# Altium schematic sheet 425AK01A_S04.SchDoc
size A3; DocumentNumber: 4; SheetNumber: 4; SheetTotal: 10; PageSetup: Record=PageOptions|CenterHorizontal=True|CenterVertical=True|PrintScale=1.01|XCorrection=1.00|YCorrection=1.00|PrintKind=1|BorderSize=5000000|LeftOffset=0|BottomOffset=0|Orientation=2|PaperLength=1000|PaperWidth=1000|Scale=100|PaperSource=15|PrintQuality=600|MediaType=1|DitherType=10|PaperKind=A3|PrintScaleMode=1; 00_Drawn: RJG; 00_Date: 8APR2022; 00_Checked: SR; 00_Approved: GN; 00_Line1: VCXO/PLL PATH A
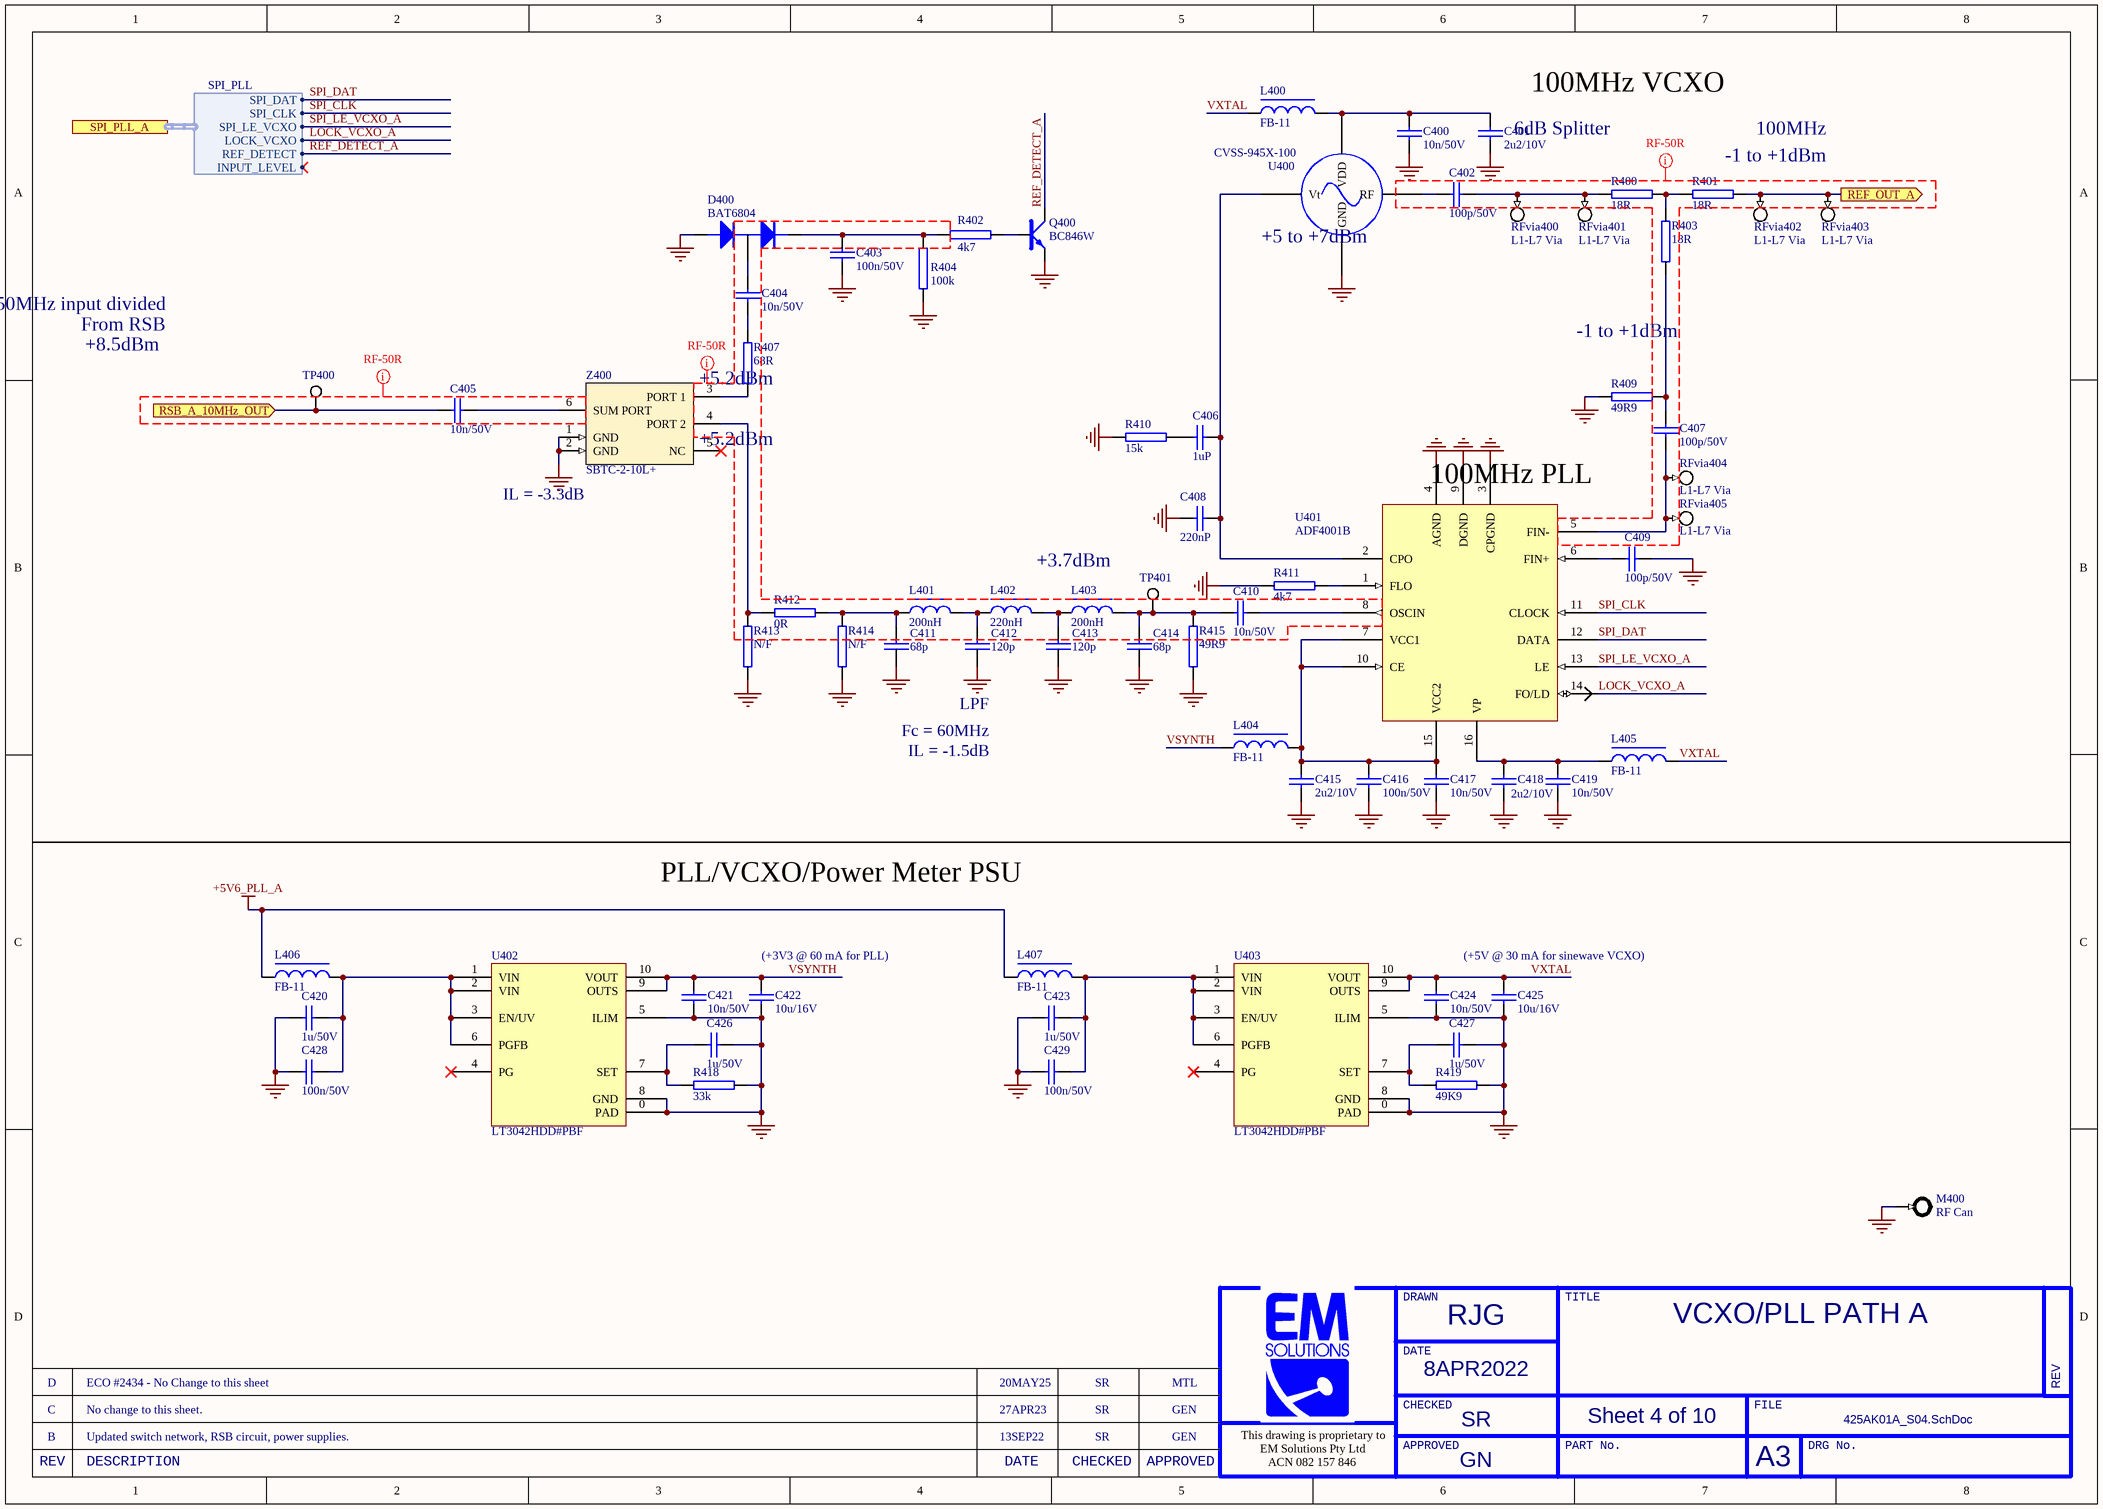
[diagram p0: 425AK01A_S04.SchDoc]

## Parts
C400  10n/50V  [0402C]
C401  2u2/10V  [0603C]
C402  100p/50V  [0402C]
C403  100n/50V  [0402C]
C404  10n/50V  [0402C]
C405  10n/50V  [0402C]
C406  1uP  [1210C]
C407  100p/50V  [0402C]
C408  220nP  [1206C]
C409  100p/50V  [0402C]
C410  10n/50V  [0402C]
C411  68p  [0402C]
C412  120p  [0402C]
C413  120p  [0402C]
C414  68p  [0402C]
C415  2u2/10V  [0603C]
C416  100n/50V  [0402C]
C417  10n/50V  [0402C]
C418  2u2/10V  [0603C]
C419  10n/50V  [0402C]
C420  1u/50V  [0603C]
C421  10n/50V  [0402C]
C422  10u/16V  [0805C]
C423  1u/50V  [0603C]
C424  10n/50V  [0402C]
C425  10u/16V  [0805C]
C426  1u/50V  [0603C]
C427  1u/50V  [0603C]
C428  100n/50V  [0402C]
C429  100n/50V  [0402C]
D400  BAT6804  [SOT-23DAP]
L400  FB-11  [0402L]
L401  200nH  [0402L]
L402  220nH  [0402L]
L403  200nH  [0402L]
L404  FB-11  [0402L]
L405  FB-11  [0402L]
L406  FB-11  [0402L]
L407  FB-11  [0402L]
M400  RF Can  [Can_38x25.4x6mm]
Q400  BC846W  [SOT-323BJT]
R400  18R  [0402]
R401  18R  [0402]
R402  4k7  [0402]
R403  18R  [0402]
R404  100k  [0402]
R407  68R  [0402]
R409  49R9  [0402]
R410  15k  [0402]
R411  4k7  [0402]
R412  0R  [0402]
R413  N/F  [0402]
R414  N/F  [0402]
R415  49R9  [0402]
R418  33k  [0402]
R419  49K9  [0402]
RFvia400  L1-L7 Via  [RFvia_L1-L7]  (no BOM)
RFvia401  L1-L7 Via  [RFvia_L1-L7]  (no BOM)
RFvia402  L1-L7 Via  [RFvia_L1-L7]  (no BOM)
RFvia403  L1-L7 Via  [RFvia_L1-L7]  (no BOM)
RFvia404  L1-L7 Via  [RFvia_L1-L7]  (no BOM)
RFvia405  L1-L7 Via  [RFvia_L1-L7]  (no BOM)
TP400  Pad  [Testpoint-0.5mm-SMT-withPaste]  (value not drawn)  (no BOM)
TP401  Pad  [Testpoint-0.5mm-SMT-withPaste]  (value not drawn)  (no BOM)
U400  CVSS-945X-100  [CVHD-950]
U401  ADF4001B  [TSSOP-16]
U402  LT3042HDD#PBF  [DFN50P300X300X80_HS-11N]
U403  LT3042HDD#PBF  [DFN50P300X300X80_HS-11N]
Z400  SBTC-2-10L+  [SBTC-2-10L+]

## Ports
REF_OUT_A (out), RSB_A_10MHz_OUT (in), SPI_PLL_A (harness SPI_PLL)

## Harnesses
SPI_PLL: SPI_LE_VCXO, SPI_CLK, SPI_DAT, REF_DETECT, LOCK_VCXO, INPUT_LEVEL

## Nets
+5V6_PLL_A: L406.2 L407.2
GND: C400.2 C401.2 C403.1 C408.1 C409.2 C411.1 C412.1 C413.1 C414.1 C415.2 C416.2 C417.2 C418.2 C419.2 C420.1 C421.1 C422.2 C423.1 C424.1 C425.2 C426.2 C427.2 C428.2 C429.2 D400.A M400.0 Q400.E R404.1 R409.2 R410.2 R411.1 R413.1 R414.1 R415.1 R418.1 R419.1 U400.2(GND) U401.3(CPGND) U401.4(AGND) U401.9(DGND) U402.0(PAD) U402.5(ILIM) U402.8(GND) U403.0(PAD) U403.5(ILIM) U403.8(GND) Z400.1(GND) Z400.2(GND)
LOCK_VCXO_A: U401.14(FO/LD) ; port SPI_PLL_A.LOCK_VCXO
REF_DETECT_A: Q400.C ; port SPI_PLL_A.REF_DETECT
REF_OUT_A: R401.2 RFvia402.1 RFvia403.1 ; port REF_OUT_A
RSB_A_10MHz_OUT: C405.1 TP400.1 ; port RSB_A_10MHz_OUT
SPI_CLK: U401.11(CLOCK) ; port SPI_PLL_A.SPI_CLK
SPI_DAT: U401.12(DATA) ; port SPI_PLL_A.SPI_DAT
SPI_LE_VCXO_A: U401.13(LE) ; port SPI_PLL_A.SPI_LE_VCXO
VSYNTH: C421.2 C422.1 L404.1 U402.9(OUTS) U402.10(VOUT)
VXTAL: C424.2 C425.1 L400.1 L405.2 U403.9(OUTS) U403.10(VOUT)
NetC400_1: C400.1 C401.1 L400.2 U400.4(VDD)
NetC402_1: C402.1 R400.1 RFvia400.1 RFvia401.1
NetC402_2: C402.2 U400.3(RF)
NetC403_2: C403.2 D400.K R402.2 R404.2
NetC404_1: C404.1 R407.2
NetC404_2: C404.2 D400.KA
NetC405_2: C405.2 Z400.6(SUM_PORT)
NetC406_1: C406.1 C408.2 U400.1(Vt) U401.2(CPO)
NetC406_2: C406.2 R410.1
NetC407_1: C407.1 R403.2 R409.1
NetC407_2: C407.2 RFvia404.1 RFvia405.1 U401.5(FIN-)
NetC409_1: C409.1 U401.6(FIN+)
NetC410_1: C410.1 C414.2 L403.2 R415.2 TP401.1
NetC410_2: C410.2 U401.8(OSCIN)
NetC411_2: C411.2 L401.1 R412.1 R414.2
NetC412_2: C412.2 L401.2 L402.1
NetC413_2: C413.2 L402.2 L403.1
NetC415_1: C415.1 C416.1 C417.1 L404.2 U401.7(VCC1) U401.10(CE) U401.15(VCC2)
NetC418_1: C418.1 C419.1 L405.1 U401.16(VP)
NetC420_2: C420.2 C428.1 L406.1 U402.1(VIN) U402.2(VIN) U402.3(EN/UV) U402.6(PGFB)
NetC423_2: C423.2 C429.1 L407.1 U403.1(VIN) U403.2(VIN) U403.3(EN/UV) U403.6(PGFB)
NetC426_1: C426.1 R418.2 U402.7(SET)
NetC427_1: C427.1 R419.2 U403.7(SET)
NetQ400_B: Q400.B R402.1
NetR400_2: R400.2 R401.1 R403.1
NetR407_1: R407.1 Z400.3(PORT_1)
NetR411_2: R411.2 U401.1(FLO)
NetR412_2: R412.2 R413.2 Z400.4(PORT_2)

Not connected (* = marked no-connect by the designer): U402 4(PG)*; U403 4(PG)*; Z400 5(NC)*

## Layout directives
net class RF-50R: (no net found under the mark)

## Notes on the sheet
- 100MHz VCXO
- 6dB Splitter
- 100MHz
- (near RFvia403) -1 to +1dBm
- (near U400) +5 to +7dBm
- 10MHz from 10MHz input or 50MHz input divided
- +8.5dBm
- From RSB
- -1 to +1dBm
- (near R407) +5.2dBm
- +5.2dBm
- (near Z400) IL = -3.3dB
- (near U401) 100MHz PLL
- +3.7dBm
- LPF
- Fc = 60MHz
- IL = -1.5dB
- PLL/VCXO/Power Meter PSU
- (near C422) (+3V3 @ 60 mA for PLL)
- (+5V @ 30 mA for sinewave VCXO)
- D
- ECO #2434 - No Change to this sheet
- 20MAY25
- SR
- MTL
- B
- C
- Updated switch network, RSB circuit, power supplies.
- No change to this sheet.
- 13SEP22
- 27APR23
- GEN
- DRAWN
- TITLE
- DATE
- REV
- This drawing is proprietary to
- EM Solutions Pty Ltd
- APPROVED
- CHECKED
- PART No.
- FILE
- A3
- DRG No.
- DESCRIPTION
- ACN 082 157 846

## Library data of the parts
C400 C404 C410 C417 C419 C421 C424 = 41-010N-12: Capacitor, 0402, 10n X7R 10% 50V Ceramic, NiSn; MANUFACTURER: MURATA; ID: 2217; MODELNAME: GCM155R71H103KA55D; Part Number: 41-010N-12; ItemID: 41-010N-12
C401 C415 C418 = 41-02U2-06: Capacitor, 0603, 2u2 X7R 10% 10V Ceramic, NiSn; MANUFACTURER: MURATA; ID: 2333; MODELNAME: GRM188R71A225KE15D; Part Number: 41-02U2-06; ItemID: 41-02U2-06
C402 = 41-100P-11: Capacitor, 0402, 100p NPO 5% 50V Ceramic, AEC-Q200; MANUFACTURER: TDK; MODELNAME: CGA2B2C0G1H101J050BA; ID: 2448; Part Number: 41-100P-11; ItemID: 41-100P-11
C403 C416 C428 C429 = 41-100N-13: Capacitor, 0402, 100n, X7R, 10% 50V, Ceramic; MANUFACTURER: MURATA; ID: 2441; MODELNAME: GRM155R71H104KE14J; Part Number: 41-100N-13; ItemID: 41-100N-13
C405 = 41-010N-12: Capacitor, 0402, 10n X7R 10% 50V Ceramic, NiSn; MANUFACTURER: MURATA; MODELNAME: GCM155R71H103KA55D; ID: 2217; Part Number: 41-010N-12; ItemID: 41-010N-12
C406 = 41-01U0-05: Capacitor, 1210, 1u PPS 20% 16V Plastic Film; MANUFACTURER: PANASONIC; ID: 2286; MODELNAME: ECPU1C105MA5; Part Number: 41-01U0-05; ItemID: 41-01U0-05
C407 C409 = 41-100P-11: Capacitor, 0402, 100p NPO 5% 50V Ceramic, AEC-Q200; MANUFACTURER: TDK; ID: 2448; MODELNAME: CGA2B2C0G1H101J050BA; Part Number: 41-100P-11; ItemID: 41-100P-11
C408 = 41-220N-05: Capacitor, 1206, 220n PPS 20% 16V Plastic Film; MANUFACTURER: PANASONIC; ID: 2468; MODELNAME: ECPU1C224MA5; Part Number: 41-220N-05; ItemID: 41-220N-05
C411 C414 = 41-068P-08: Capacitor, 0402, 68p; Part Number: 41-068P-08
C412 C413 = 41-120P-05: Capacitor, 0402, 120p NPO; Part Number: 41-120P-05
C420 C423 C426 C427 = 41-01U0-06: Capacitor, 0603, 1u X7R 10% 50V Ceramic, NiSn; MANUFACTURER: TAIYOYUDEN; MODELNAME: UMK107AB7105KA; ID: 2287; Part Number: 41-01U0-06; ItemID: 41-01U0-06
C422 C425 = 41-010U-08: Capacitor, 0805, 10u X7R 10% 16V Ceramic, NiSn; MANUFACTURER: SAMSUNG; ID: 2232; MODELNAME: CL21B106KOQNNNE; Part Number: 41-010U-08; ItemID: 41-010U-08
D400 = 60-BAT68-04: *Diode, Schottky, Series Pair, 8V 130mA, SOT-23-3; MANUFACTURER: INFINEON; ID: 3625; MODELNAME: BAT6804E6327HTSA1; Part Number: 60-BAT68-04; ItemID: 60-BAT68-04
L400 L404 L405 = 46-B-11: Solid Inductor, 600ohm@100MHz, DCR=0.52, 0.3A, 0402 size; MANUFACTURER: TDK; ID: 3256; MODELNAME: MMZ1005S601C; Part Number: 46-B-11; ItemID: 46-B-11
L401 L403 = 46-200N-04: Inductor, Chip, 200nH, 0402; Part Number: 46-200N-04
L402 = 46-220N-05: Inductor, Chip, 220nH, 0402; Part Number: 46-220N-05
L406 L407 = 46-B-11: Solid Inductor, 600ohm@100MHz, DCR=0.52, 0.3A, 0402 size; MANUFACTURER: TDK; MODELNAME: MMZ1005S601C; ID: 3256; Part Number: 46-B-11; ItemID: 46-B-11
M400 = Can-RF: Part Number: 11-0256
Q400 = 62-BC846-01: Transistor, NPN Si, GenPur 65V 100mA, SOT-323; MANUFACTURER: TAIWAN SEMI; ID: 3683; MODELNAME: BC846CW RF; Part Number: 62-BC846-01; ItemID: 62-BC846-01
R400 R401 R403 = 44-018R-10: Resistor, 0402, 18R 1% 0.063W; MANUFACTURER: GENERIC; ID: 2594; Part Number: 44-018R-10; ItemID: 44-018R-10; MODELNAME: GENERIC
R402 R411 = 44-04K7-10: Resistor, 0402, 4k7 1% 0.063W; MANUFACTURER: PHILIPS; ID: 2794; MODELNAME: ERJ-2RKF4701X; Part Number: 44-04K7-10; ItemID: 44-04K7-10
R404 = 44-100K-10: Resistor, 0402, 100k 1% 0.063W; MANUFACTURER: PHILIPS; ID: 2931; MODELNAME: RC32H; Part Number: 44-100K-10; ItemID: 44-100K-10
R407 = 44-068R-10: Resistor, 0402, 68R 1% 0.063W; MANUFACTURER: PHILIPS; MODELNAME: RC32H; ID: 2849; Part Number: 44-068R-10; ItemID: 44-068R-10
R409 R415 = 44-049R9-10: Resistor, 0402, 49R9 1% 0.063W; MANUFACTURER: YAGEO; ID: 2787; MODELNAME: RC0402FR-0749R9L; Part Number: 44-049R9-10; ItemID: 44-049R9-10
R410 = 44-015K-10: Resistor, 0402, 15k 1% 0.063W; MANUFACTURER: PHILIPS; MODELNAME: RC32H; ID: 2575; Part Number: 44-015K-10; ItemID: 44-015K-10
R412 = 44-000R-10: Resistor, 0402, 0R 1% 0.063W; MANUFACTURER: GENERIC; ID: 2538; Part Number: 44-000R-10; ItemID: 44-000R-10; MODELNAME: GENERIC
R413 R414 = 44-N/F-10: Resistor, 0402, SOT, Not Fitted; ID: 3111; Part Number: 44-N/F-10; ItemID: 44-N/F-10
R418 = 44-033K-10: Resistor, 0402, 33k 1% 0.063W; MANUFACTURER: PHILIPS; MODELNAME: RC32H; ID: 2720; Part Number: 44-033K-10; ItemID: 44-033K-10
R419 = 44-49K9-01: Resistor, 0402, 49.9K, 1%, 0.1W, ThickFilm, AEC-Q200; MANUFACTURER: PANASONIC; MODELNAME: ERJ-2RKF4992X; ID: 3061; Part Number: 44-49K9-01; ItemID: 44-49K9-01
RFvia400-RFvia405 = RFvia_L1-L7: RF Via from layer 1 to layer 7, on an 8-layer board.; Rule: UNIONINDEX=0|RULEKIND=PlaneClearance|NETSCOPE=AnyNet|LAYERKIND=SameLayer|NAME=Schematic Power Plane Clearance|CLEARANCE=13.7795mil|UNIT=Imperial
TP400 TP401 = Pad: Pad that can be a test point or a hot via
U400 = 35-0223: VCXO, 100.00MHz, Sine 5V, SMD; MANUFACTURER: CRYSTEK; ID: 2098; Part Number: 35-0223; ItemID: 35-0223; MODELNAME: CVSS-945X-100
U401 = 54-4001-01: PLL Clock Gen, 200MHz, Serial TSSOP-16; MANUFACTURER: ANLG DEV; ID: 3488; Part Number: 54-4001-01; ItemID: 54-4001-01; MODELNAME: ADF4001BRUZ
U402 U403 = 52-3042-01: Volt Regulator, Vin=1.8-20V, Vin=0-15V, 200mA, Low Noise, -40to+125C; MANUFACTURER: ANLG DEV; MODELNAME: LT3042IDD#PBF; ID: 3361; Part Number: 52-3042-01; ItemID: 52-3042-01
Z400 = 33-0055: Divider/Combiner, 2 Way, 0 deg, 10 -1000MHz, Tx Line Tranformer; MANUFACTURER: MINICCTS; ID: 2075; Part Number: 33-0055; MODELNAME: SBTC-2-10L+; ItemID: 33-0055